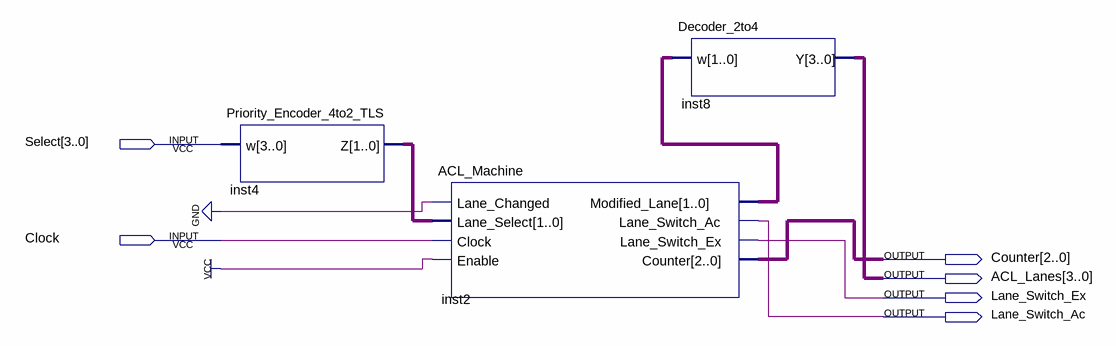
[diagram p0: schematic sheet]
// Quartus schematic ACL_Test.bdf as structural Verilog: 3 symbols, 6 pins
module ACL_Test (
  input  [3:0] Select,
  input  Clock,
  output [2:0] Counter,
  output [3:0] ACL_Lanes,
  output Lane_Switch_Ex,
  output Lane_Switch_Ac
);

  wire [1:0] inst2_modified_lane, inst4_z;

  Priority_Encoder_4to2_TLS inst4 (.w(Select), .Z(inst4_z));
  ACL_Machine inst2 (
    .Lane_Changed(1'b0), .Lane_Select(inst4_z), .Clock(Clock), .Enable(1'b1),
    .Modified_Lane(inst2_modified_lane), .Lane_Switch_Ac(Lane_Switch_Ac), .Lane_Switch_Ex(Lane_Switch_Ex),
    .Counter(Counter));
  Decoder_2to4 inst8 (.w(inst2_modified_lane), .Y(ACL_Lanes));
endmodule
